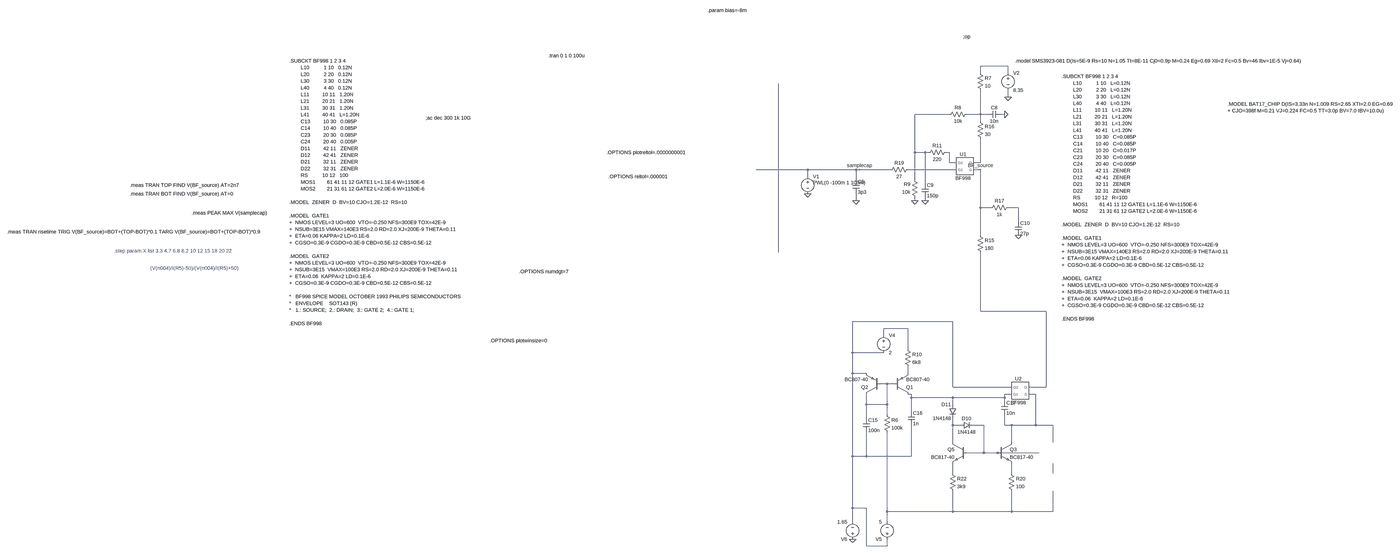
[diagram p0: schematic Draft20_transfer.asc, whole sheet]
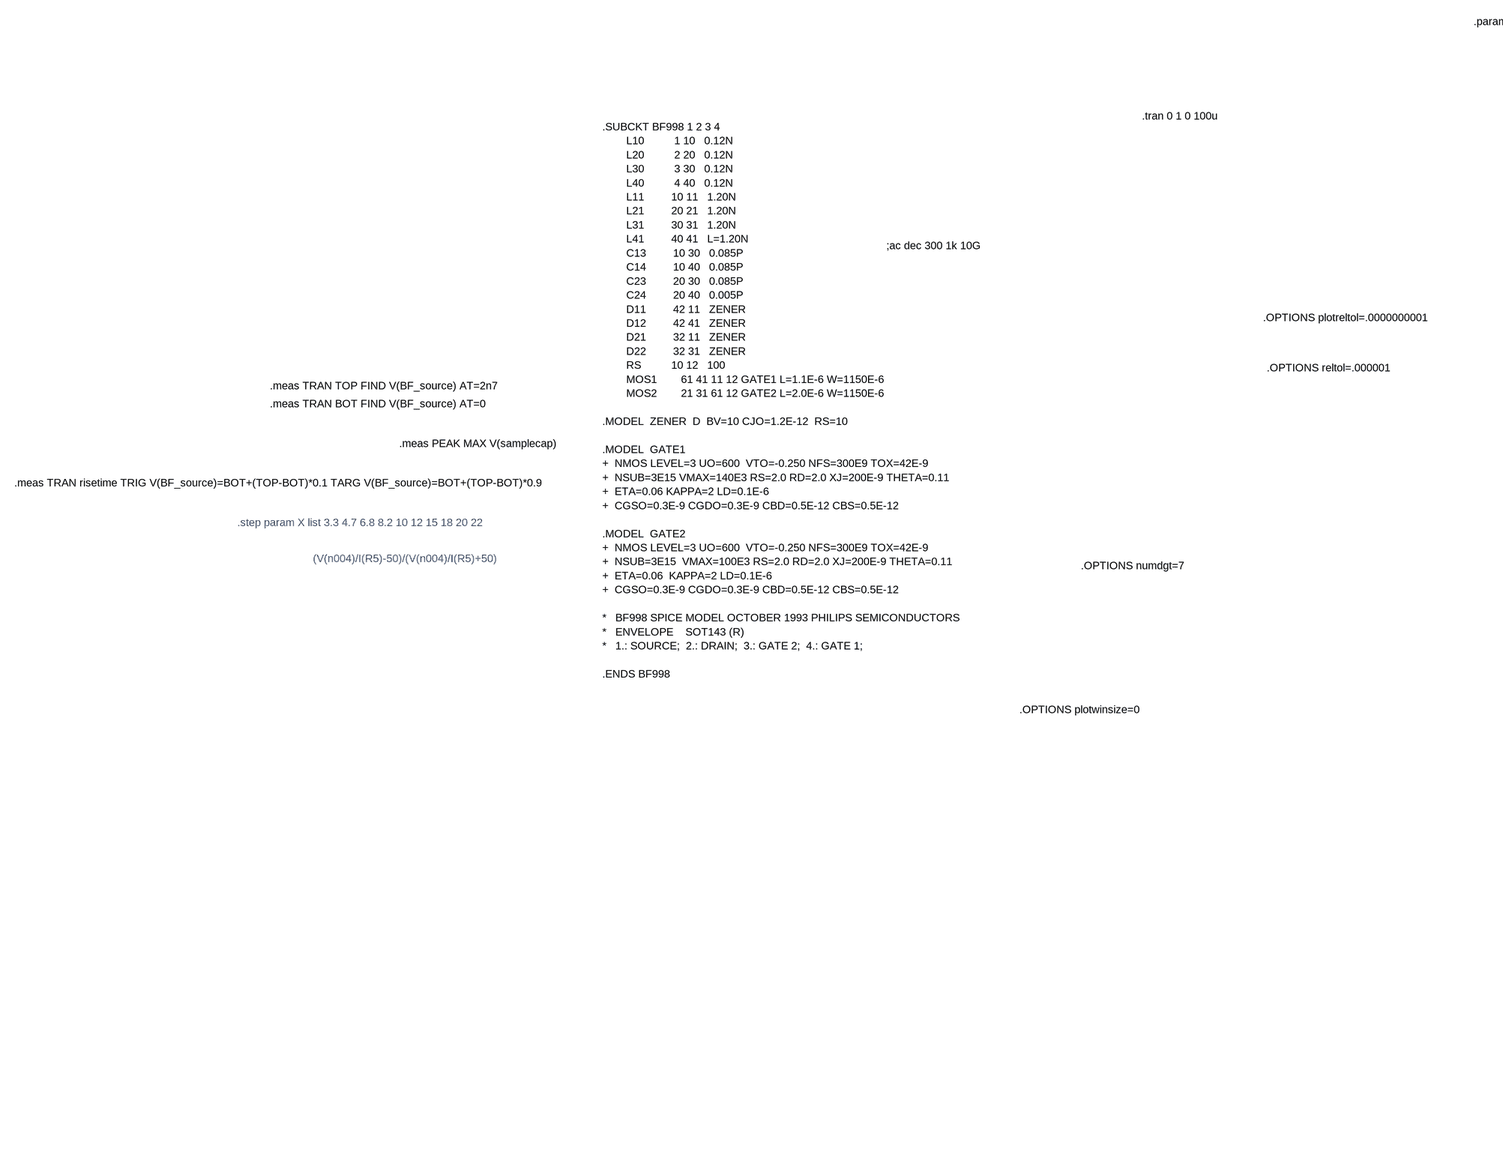
[diagram p1: schematic Draft20_transfer.asc, part, row 1 of 1, column 1 of 2]
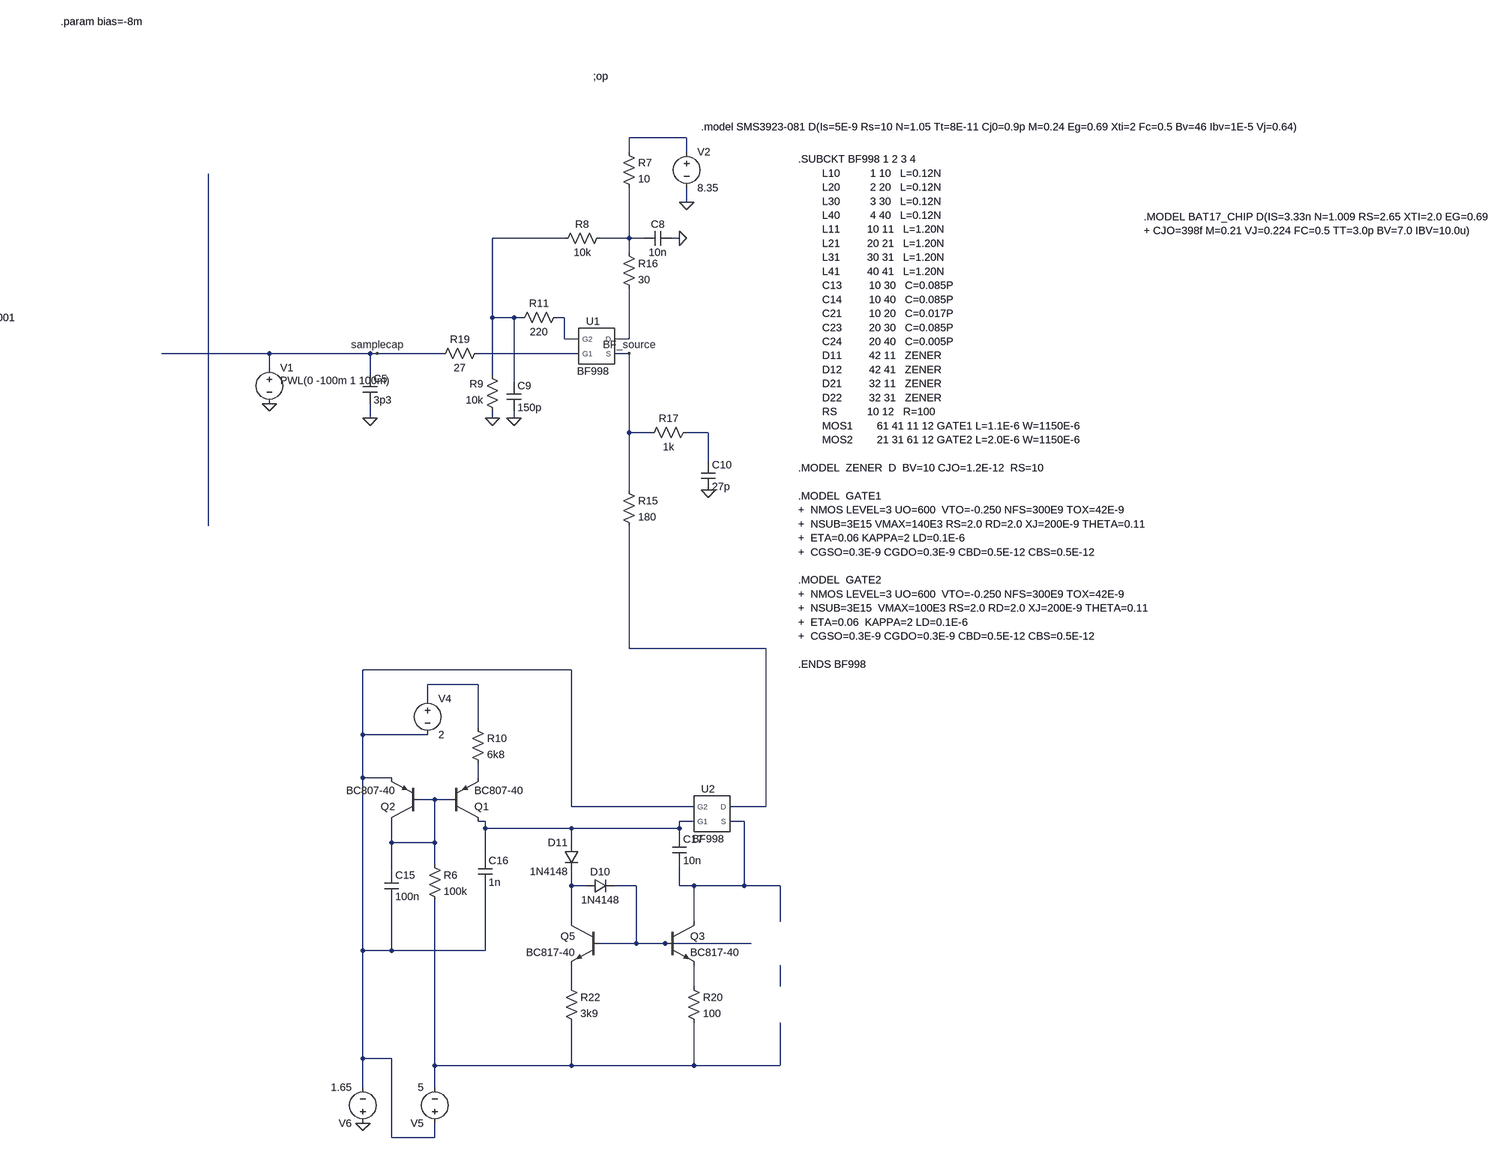
[diagram p2: schematic Draft20_transfer.asc, part, row 1 of 1, column 2 of 2]
Draft20_transfer.asc, the LTspice schematic file:
Version 4
SHEET 1 3404 2260
WIRE 992 32 864 32
WIRE 864 64 864 32
WIRE 992 64 992 32
WIRE 992 176 992 144
WIRE 720 256 560 256
WIRE 864 256 864 144
WIRE 864 256 800 256
WIRE 896 256 864 256
WIRE 976 256 960 256
WIRE 864 288 864 256
WIRE 560 432 560 256
WIRE 608 432 560 432
WIRE 624 432 608 432
WIRE 720 432 704 432
WIRE 720 480 720 432
WIRE 752 480 720 480
WIRE 864 480 864 368
WIRE 864 480 832 480
WIRE 64 512 -304 512
WIRE 288 512 64 512
WIRE 304 512 288 512
WIRE 448 512 304 512
WIRE 752 512 528 512
WIRE 864 512 832 512
WIRE 64 544 64 512
WIRE 288 560 288 512
WIRE 560 560 560 432
WIRE 608 576 608 432
WIRE 288 656 288 624
WIRE 560 656 560 640
WIRE 608 656 608 640
WIRE 864 688 864 512
WIRE 912 688 864 688
WIRE 1040 688 992 688
WIRE 1040 752 1040 688
WIRE 864 816 864 688
WIRE -128 896 -128 112
WIRE 864 1168 864 896
WIRE 1168 1168 864 1168
WIRE 736 1216 272 1216
WIRE 528 1248 416 1248
WIRE 416 1280 416 1248
WIRE 528 1344 528 1248
WIRE 272 1360 272 1216
WIRE 416 1360 272 1360
WIRE 272 1456 272 1360
WIRE 336 1456 272 1456
WIRE 528 1456 528 1424
WIRE 432 1504 400 1504
WIRE 464 1504 432 1504
WIRE 736 1520 736 1216
WIRE 1008 1520 736 1520
WIRE 1168 1520 1168 1168
WIRE 1168 1520 1088 1520
WIRE 544 1552 528 1552
WIRE 1008 1552 976 1552
WIRE 1120 1552 1088 1552
WIRE 544 1568 544 1552
WIRE 736 1568 544 1568
WIRE 976 1568 976 1552
WIRE 976 1568 736 1568
WIRE 976 1584 976 1568
WIRE 336 1600 336 1552
WIRE 432 1600 432 1504
WIRE 432 1600 336 1600
WIRE 736 1600 736 1568
WIRE 544 1632 544 1568
WIRE 432 1648 432 1600
WIRE 336 1664 336 1600
WIRE 736 1696 736 1664
WIRE 768 1696 736 1696
WIRE 880 1696 832 1696
WIRE 976 1696 976 1648
WIRE 1008 1696 976 1696
WIRE 1120 1696 1120 1552
WIRE 1120 1696 1008 1696
WIRE 1200 1696 1120 1696
WIRE 736 1776 736 1696
WIRE 1008 1776 1008 1696
WIRE 1200 1776 1200 1696
WIRE 880 1824 880 1696
WIRE 880 1824 800 1824
WIRE 944 1824 880 1824
WIRE 1136 1824 944 1824
WIRE 272 1840 272 1456
WIRE 336 1840 336 1728
WIRE 336 1840 272 1840
WIRE 544 1840 544 1696
WIRE 544 1840 336 1840
WIRE 736 1920 736 1872
WIRE 1008 1920 1008 1872
WIRE 1200 1920 1200 1872
WIRE 272 2080 272 1840
WIRE 336 2080 272 2080
WIRE 432 2096 432 1728
WIRE 736 2096 736 2000
WIRE 736 2096 432 2096
WIRE 1008 2096 1008 2000
WIRE 1008 2096 736 2096
WIRE 1200 2096 1200 2000
WIRE 1200 2096 1008 2096
WIRE 272 2144 272 2080
WIRE 432 2144 432 2096
WIRE 336 2256 336 2080
WIRE 432 2256 432 2224
WIRE 432 2256 336 2256
FLAG 288 656 0
FLAG 560 656 0
FLAG 976 256 0
FLAG 608 656 0
FLAG 992 176 0
FLAG 1040 816 0
FLAG 304 512 samplecap
FLAG 864 512 BF_source
FLAG 272 2224 0
FLAG 64 624 0
SYMBOL cap 272 560 R0
SYMATTR InstName C5
SYMATTR Value 3p3
SYMBOL cap 960 240 R90
WINDOW 0 0 32 VBottom 2
WINDOW 3 32 32 VTop 2
SYMATTR InstName C8
SYMATTR Value 10n
SYMBOL res 848 48 R0
SYMATTR InstName R7
SYMATTR Value 10
SYMBOL res 816 240 R90
WINDOW 0 0 56 VBottom 2
WINDOW 3 32 56 VTop 2
SYMATTR InstName R8
SYMATTR Value 10k
SYMBOL res 576 656 R180
WINDOW 0 36 76 Left 2
WINDOW 3 36 40 Left 2
SYMATTR InstName R9
SYMATTR Value 10k
SYMBOL cap 592 576 R0
SYMATTR InstName C9
SYMATTR Value 150p
SYMBOL voltage 992 48 R0
WINDOW 123 0 0 Left 0
WINDOW 39 0 0 Left 0
SYMATTR InstName V2
SYMATTR Value 8.35
SYMBOL AutoGenerated\\BF998 784 496 R0
SYMATTR InstName U1
SYMBOL res 848 800 R0
SYMATTR InstName R15
SYMATTR Value 180
SYMBOL cap 1024 752 R0
SYMATTR InstName C10
SYMATTR Value 27p
SYMBOL res 848 272 R0
SYMATTR InstName R16
SYMATTR Value 30
SYMBOL res 1008 672 R90
WINDOW 0 0 56 VBottom 2
WINDOW 3 32 56 VTop 2
SYMATTR InstName R17
SYMATTR Value 1k
SYMBOL res 544 496 R90
WINDOW 0 0 56 VBottom 2
WINDOW 3 32 56 VTop 2
SYMATTR InstName R19
SYMATTR Value 27
SYMBOL res 720 416 R90
WINDOW 0 0 56 VBottom 2
WINDOW 3 32 56 VTop 2
SYMATTR InstName R11
SYMATTR Value 220
SYMBOL pnp 464 1552 M180
SYMATTR InstName Q1
SYMATTR Value BC807-40
SYMBOL pnp 400 1552 R180
SYMATTR InstName Q2
SYMATTR Value BC807-40
SYMBOL res 416 1632 R0
SYMATTR InstName R6
SYMATTR Value 100k
SYMBOL cap 320 1664 R0
SYMATTR InstName C15
SYMATTR Value 100n
SYMBOL res 512 1328 R0
SYMATTR InstName R10
SYMATTR Value 6k8
SYMBOL voltage 416 1264 R0
WINDOW 123 0 0 Left 0
WINDOW 39 0 0 Left 0
SYMATTR InstName V4
SYMATTR Value 2
SYMBOL voltage 432 2240 R180
WINDOW 123 0 0 Left 0
WINDOW 39 0 0 Left 0
SYMATTR InstName V5
SYMATTR Value 5
SYMBOL cap 528 1632 R0
SYMATTR InstName C16
SYMATTR Value 1n
SYMBOL diode 768 1712 R270
WINDOW 0 32 32 VTop 2
WINDOW 3 0 32 VBottom 2
SYMATTR InstName D10
SYMATTR Value 1N4148
SYMBOL npn 800 1776 M0
SYMATTR InstName Q5
SYMATTR Value BC817-40
SYMBOL npn 944 1776 R0
SYMATTR InstName Q3
SYMATTR Value BC817-40
SYMBOL res 992 1904 R0
SYMATTR InstName R20
SYMATTR Value 100
SYMBOL res 720 1904 R0
SYMATTR InstName R22
SYMATTR Value 3k9
SYMBOL diode 752 1600 M0
SYMATTR InstName D11
SYMATTR Value 1N4148
SYMBOL AutoGenerated\\BF998 1040 1536 R0
SYMATTR InstName U2
SYMBOL cap 960 1584 R0
SYMATTR InstName C17
SYMATTR Value 10n
SYMBOL voltage 272 2240 R180
WINDOW 123 0 0 Left 0
WINDOW 39 0 0 Left 0
SYMATTR InstName V6
SYMATTR Value 1.65
SYMBOL voltage 64 528 R0
WINDOW 3 24 44 Left 2
WINDOW 123 0 0 Left 0
WINDOW 39 0 0 Left 0
SYMATTR InstName V1
SYMATTR Value PWL(0 -100m 1 100m)
TEXT 1024 8 Left 2 !.model SMS3923-081 D(Is=5E-9 Rs=10 N=1.05 Tt=8E-11 Cj0=0.9p M=0.24 Eg=0.69 Xti=2 Fc=0.5 Bv=46 Ibv=1E-5 Vj=0.64)
TEXT 784 -104 Left 2 !;op
TEXT -1896 -16 Left 2 !.tran 0 1 0 100u
TEXT 1240 80 Left 2 !.SUBCKT BF998 1 2 3 4\n        L10          1 10   L=0.12N\n        L20          2 20   L=0.12N\n        L30          3 30   L=0.12N\n        L40          4 40   L=0.12N\n        L11         10 11   L=1.20N\n        L21         20 21   L=1.20N\n        L31         30 31   L=1.20N\n        L41         40 41   L=1.20N\n        C13         10 30   C=0.085P\n        C14         10 40   C=0.085P\n        C21         10 20   C=0.017P\n        C23         20 30   C=0.085P\n        C24         20 40   C=0.005P\n        D11         42 11   ZENER\n        D12         42 41   ZENER\n        D21         32 11   ZENER\n        D22         32 31   ZENER\n        RS          10 12   R=100\n        MOS1        61 41 11 12 GATE1 L=1.1E-6 W=1150E-6\n        MOS2        21 31 61 12 GATE2 L=2.0E-6 W=1150E-6\n \n.MODEL  ZENER  D  BV=10 CJO=1.2E-12  RS=10\n \n.MODEL  GATE1\n+  NMOS LEVEL=3 UO=600  VTO=-0.250 NFS=300E9 TOX=42E-9\n+  NSUB=3E15 VMAX=140E3 RS=2.0 RD=2.0 XJ=200E-9 THETA=0.11\n+  ETA=0.06 KAPPA=2 LD=0.1E-6\n+  CGSO=0.3E-9 CGDO=0.3E-9 CBD=0.5E-12 CBS=0.5E-12\n \n.MODEL  GATE2 \n+  NMOS LEVEL=3 UO=600  VTO=-0.250 NFS=300E9 TOX=42E-9\n+  NSUB=3E15  VMAX=100E3 RS=2.0 RD=2.0 XJ=200E-9 THETA=0.11\n+  ETA=0.06  KAPPA=2 LD=0.1E-6\n+  CGSO=0.3E-9 CGDO=0.3E-9 CBD=0.5E-12 CBS=0.5E-12\n \n.ENDS BF998
TEXT -3096 8 Left 2 !.SUBCKT BF998 1 2 3 4\n        L10          1 10   0.12N\n        L20          2 20   0.12N\n        L30          3 30   0.12N\n        L40          4 40   0.12N\n        L11         10 11   1.20N\n        L21         20 21   1.20N\n        L31         30 31   1.20N\n        L41         40 41   L=1.20N\n        C13         10 30   0.085P\n        C14         10 40   0.085P\n        C23         20 30   0.085P\n        C24         20 40   0.005P\n        D11         42 11   ZENER\n        D12         42 41   ZENER\n        D21         32 11   ZENER\n        D22         32 31   ZENER\n        RS          10 12   100\n        MOS1        61 41 11 12 GATE1 L=1.1E-6 W=1150E-6\n        MOS2        21 31 61 12 GATE2 L=2.0E-6 W=1150E-6\n \n.MODEL  ZENER  D  BV=10 CJO=1.2E-12  RS=10\n \n.MODEL  GATE1\n+  NMOS LEVEL=3 UO=600  VTO=-0.250 NFS=300E9 TOX=42E-9\n+  NSUB=3E15 VMAX=140E3 RS=2.0 RD=2.0 XJ=200E-9 THETA=0.11\n+  ETA=0.06 KAPPA=2 LD=0.1E-6\n+  CGSO=0.3E-9 CGDO=0.3E-9 CBD=0.5E-12 CBS=0.5E-12\n \n.MODEL  GATE2\n+  NMOS LEVEL=3 UO=600  VTO=-0.250 NFS=300E9 TOX=42E-9\n+  NSUB=3E15  VMAX=100E3 RS=2.0 RD=2.0 XJ=200E-9 THETA=0.11\n+  ETA=0.06  KAPPA=2 LD=0.1E-6\n+  CGSO=0.3E-9 CGDO=0.3E-9 CBD=0.5E-12 CBS=0.5E-12\n \n*   BF998 SPICE MODEL OCTOBER 1993 PHILIPS SEMICONDUCTORS\n*   ENVELOPE    SOT143 (R)\n*   1.: SOURCE;  2.: DRAIN;  3.: GATE 2;  4.: GATE 1;\n \n.ENDS BF998
TEXT -4024 888 Left 2 ;.step param X list 3.3 4.7 6.8 8.2 10 12 15 18 20 22
TEXT -3952 584 Left 2 !.meas TRAN TOP FIND V(BF_source) AT=2n7
TEXT -3952 624 Left 2 !.meas TRAN BOT FIND V(BF_source) AT=0
TEXT -4520 800 Left 2 !.meas TRAN risetime TRIG V(BF_source)=BOT+(TOP-BOT)*0.1 TARG V(BF_source)=BOT+(TOP-BOT)*0.9
TEXT -3664 712 Left 2 !.meas PEAK MAX V(samplecap)
TEXT -2464 272 Left 2 !;ac dec 300 1k 10G
TEXT -3856 968 Left 2 ;(V(n004)/I(R5)-50)/(V(n004)/I(R5)+50)
TEXT 2008 208 Left 2 !.MODEL BAT17_CHIP D(IS=3.33n N=1.009 RS=2.65 XTI=2.0 EG=0.69\n+ CJO=398f M=0.21 VJ=0.224 FC=0.5 TT=3.0p BV=7.0 IBV=10.0u)
TEXT -528 -368 Left 2 !.param bias=-8m
TEXT -2168 1304 Left 2 !.OPTIONS plotwinsize=0
TEXT -2032 984 Left 2 !.OPTIONS numdgt=7
TEXT -1160 544 Left 2 !.OPTIONS reltol=.000001
TEXT -1168 432 Left 2 !.OPTIONS plotreltol=.0000000001

The netlist it stands for:
* Draft20_transfer.asc
C5 samplecap 0 3p3
C8 0 N003 10n
R7 N001 N003 10
R8 N003 N002 10k
R9 0 N002 10k
C9 N002 0 150p
V2 N001 0 8.35
XU1 BF_source N005 N004 N006 BF998  ; pins S D G2 G1
R15 BF_source N009 180
C10 N007 0 27p
R16 N003 N005 30
R17 N007 BF_source 1k
R19 N006 samplecap 27
R11 N004 N002 220
Q1 N014 N013 N012 0 BC807-40
Q2 N013 N013 N010 0 BC807-40
R6 N013 N021 100k
C15 N013 N010 100n
R10 N011 N012 6k8
V4 N011 N010 2
V5 N010 N021 5
C16 N014 N010 1n
D10 N016 N017 1N4148
Q5 N016 N017 N018 0 BC817-40
Q3 N015 N017 N019 0 BC817-40
R20 N019 N021 100
R22 N018 N021 3k9
D11 N014 N016 1N4148
XU2 N015 N009 N010 N014 BF998  ; pins S D G2 G1
C17 N014 N015 10n
V6 0 N010 1.65
V1 samplecap 0 PWL(0 -100m 1 100m)
.model D D
.lib standard.dio
.model NPN NPN
.model PNP PNP
.lib standard.bjt
.model SMS3923-081 D(Is=5E-9 Rs=10 N=1.05 Tt=8E-11 Cj0=0.9p M=0.24 Eg=0.69 Xti=2 Fc=0.5 Bv=46 Ibv=1E-5 Vj=0.64)
;op
.tran 0 1 0 100u
.SUBCKT BF998 1 2 3 4
        L10          1 10   L=0.12N
        L20          2 20   L=0.12N
        L30          3 30   L=0.12N
        L40          4 40   L=0.12N
        L11         10 11   L=1.20N
        L21         20 21   L=1.20N
        L31         30 31   L=1.20N
        L41         40 41   L=1.20N
        C13         10 30   C=0.085P
        C14         10 40   C=0.085P
        C21         10 20   C=0.017P
        C23         20 30   C=0.085P
        C24         20 40   C=0.005P
        D11         42 11   ZENER
        D12         42 41   ZENER
        D21         32 11   ZENER
        D22         32 31   ZENER
        RS          10 12   R=100
        MOS1        61 41 11 12 GATE1 L=1.1E-6 W=1150E-6
        MOS2        21 31 61 12 GATE2 L=2.0E-6 W=1150E-6
.MODEL  ZENER  D  BV=10 CJO=1.2E-12  RS=10
.MODEL  GATE1
+  NMOS LEVEL=3 UO=600  VTO=-0.250 NFS=300E9 TOX=42E-9
+  NSUB=3E15 VMAX=140E3 RS=2.0 RD=2.0 XJ=200E-9 THETA=0.11
+  ETA=0.06 KAPPA=2 LD=0.1E-6
+  CGSO=0.3E-9 CGDO=0.3E-9 CBD=0.5E-12 CBS=0.5E-12
.MODEL  GATE2
+  NMOS LEVEL=3 UO=600  VTO=-0.250 NFS=300E9 TOX=42E-9
+  NSUB=3E15  VMAX=100E3 RS=2.0 RD=2.0 XJ=200E-9 THETA=0.11
+  ETA=0.06  KAPPA=2 LD=0.1E-6
+  CGSO=0.3E-9 CGDO=0.3E-9 CBD=0.5E-12 CBS=0.5E-12
.ENDS BF998
.SUBCKT BF998 1 2 3 4
        L10          1 10   0.12N
        L20          2 20   0.12N
        L30          3 30   0.12N
        L40          4 40   0.12N
        L11         10 11   1.20N
        L21         20 21   1.20N
        L31         30 31   1.20N
        L41         40 41   L=1.20N
        C13         10 30   0.085P
        C14         10 40   0.085P
        C23         20 30   0.085P
        C24         20 40   0.005P
        D11         42 11   ZENER
        D12         42 41   ZENER
        D21         32 11   ZENER
        D22         32 31   ZENER
        RS          10 12   100
        MOS1        61 41 11 12 GATE1 L=1.1E-6 W=1150E-6
        MOS2        21 31 61 12 GATE2 L=2.0E-6 W=1150E-6
.MODEL  ZENER  D  BV=10 CJO=1.2E-12  RS=10
.MODEL  GATE1
+  NMOS LEVEL=3 UO=600  VTO=-0.250 NFS=300E9 TOX=42E-9
+  NSUB=3E15 VMAX=140E3 RS=2.0 RD=2.0 XJ=200E-9 THETA=0.11
+  ETA=0.06 KAPPA=2 LD=0.1E-6
+  CGSO=0.3E-9 CGDO=0.3E-9 CBD=0.5E-12 CBS=0.5E-12
.MODEL  GATE2
+  NMOS LEVEL=3 UO=600  VTO=-0.250 NFS=300E9 TOX=42E-9
+  NSUB=3E15  VMAX=100E3 RS=2.0 RD=2.0 XJ=200E-9 THETA=0.11
+  ETA=0.06  KAPPA=2 LD=0.1E-6
+  CGSO=0.3E-9 CGDO=0.3E-9 CBD=0.5E-12 CBS=0.5E-12
*   BF998 SPICE MODEL OCTOBER 1993 PHILIPS SEMICONDUCTORS
*   ENVELOPE    SOT143 (R)
*   1.: SOURCE;  2.: DRAIN;  3.: GATE 2;  4.: GATE 1;
.ENDS BF998
* .step param X list 3.3 4.7 6.8 8.2 10 12 15 18 20 22
.meas TRAN TOP FIND V(BF_source) AT=2n7
.meas TRAN BOT FIND V(BF_source) AT=0
.meas TRAN risetime TRIG V(BF_source)=BOT+(TOP-BOT)*0.1 TARG V(BF_source)=BOT+(TOP-BOT)*0.9
.meas PEAK MAX V(samplecap)
;ac dec 300 1k 10G
* (V(n004)/I(R5)-50)/(V(n004)/I(R5)+50)
.MODEL BAT17_CHIP D(IS=3.33n N=1.009 RS=2.65 XTI=2.0 EG=0.69
+ CJO=398f M=0.21 VJ=0.224 FC=0.5 TT=3.0p BV=7.0 IBV=10.0u)
.param bias=-8m
.OPTIONS plotwinsize=0
.OPTIONS numdgt=7
.OPTIONS reltol=.000001
.OPTIONS plotreltol=.0000000001
.lib Z:\home\msboss\Downloads\BF998.prm
.backanno
.end